# Altium project MEOWPOWER.PrjPcb
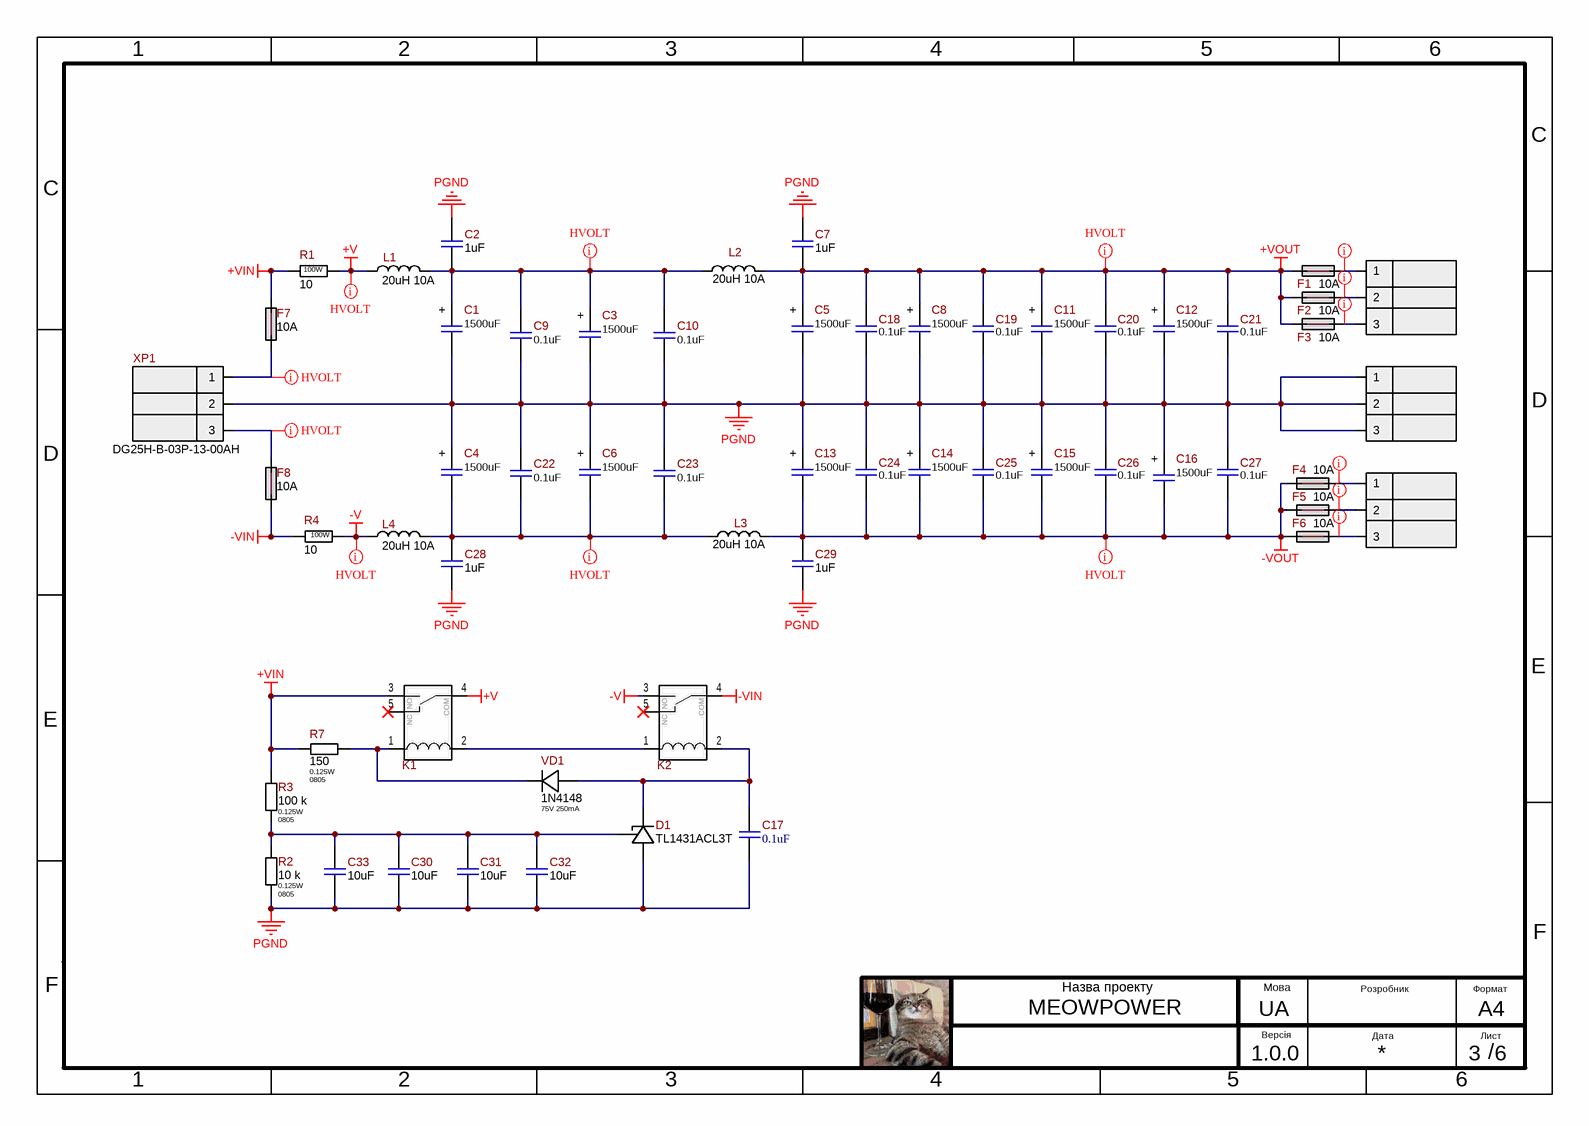
[diagram p0: MEOWPOWER.SchDoc]
__Project_Template_Version: 1.0.3; _PCB_Order_Thickness: 1.6 mm; _PCB_Order_Size: 0 x 0 mm; _PCB_Order_SilkColor: White; _PCB_Order_Silk: Yes; _PCB_Order_ProductionTime: 2 weeks; _PCB_Order_MinHole: 0.3 mm; _PCB_Order_Material: FR-4; _PCB_Order_MaskColor: Green / Yellow; _PCB_Order_Mask: on both sides; _PCB_Order_LayersCnt: 2; _PCB_Order_Finish: HASL; _PCB_Order_ElectricTest: Necessarily for 100% samples; _PCB_Order_Cooper: 1oz / 35um; _PCB_Order_CastellatedHolesEdges: No; _PCB_Order_BoardOutlineLayer: Mechanical1 (GM1); _PCB_Order_Accuracy: 0.2mm / 8mil; _Amount_Boards_Per_Stand: 1; Project_Version: 1.0.0; Product_Name: MEOWPOWER; Authors: Kozyr.I
1 sheet, 58 parts. Net scope: global (net labels, ports and power ports of the same name join across sheets).
Board file: MEOWPOWER.PcbDoc

## Sheet MEOWPOWER.SchDoc: =DocumentName
size 297 x 209 mm; Author: Kozyr.I; CompanyName: "AS Manufacturing" LLC; Organization: "AS Manufacturing" LLC; Address1: 5 Sklyarenka St.; Address2: Kyiv 04073; Address3: Ukraine; Address4: https://ajax.systems/en/; DocumentNumber: 3; Revision: v1.0.0; SheetNumber: 3; SheetTotal: 6; Product name: MEOWPOWER; Head: MEOWPOWER..v1.0.0; PCB_Designator: MEOWPOWER..v1.0.0; Template_version: 1.0.1

### Parts
C1  1500uF  [CAP-AE-PTH-180D05x400H20]
C2  1uF  [CAP 25x10MM]
C3  1500uF  [CAP-AE-PTH-180D05x400H20]
C4  1500uF  [CAP-AE-PTH-180D05x400H20]
C5  1500uF  [CAP-AE-PTH-180D05x400H20]
C6  1500uF  [CAP-AE-PTH-180D05x400H20]
C7  1uF  [CAP 25x10MM]
C8  1500uF  [CAP-AE-PTH-180D05x400H20]
C9  0.1uF  [C1206(3216)]
C10  0.1uF  [C1206(3216)]
C11  1500uF  [CAP-AE-PTH-180D05x400H20]
C12  1500uF  [CAP-AE-PTH-180D05x400H20]
C13  1500uF  [CAP-AE-PTH-180D05x400H20]
C14  1500uF  [CAP-AE-PTH-180D05x400H20]
C15  1500uF  [CAP-AE-PTH-180D05x400H20]
C16  1500uF  [CAP-AE-PTH-180D05x400H20]
C17  0.1uF  [C0805(2012)]
C18  0.1uF  [C1206(3216)]
C19  0.1uF  [C1206(3216)]
C20  0.1uF  [C1206(3216)]
C21  0.1uF  [C1206(3216)]
C22  0.1uF  [C1206(3216)]
C23  0.1uF  [C1206(3216)]
C24  0.1uF  [C1206(3216)]
C25  0.1uF  [C1206(3216)]
C26  0.1uF  [C1206(3216)]
C27  0.1uF  [C1206(3216)]
C28  1uF  [CAP 25x10MM]
C29  1uF  [CAP 25x10MM]
C30  10uF  [C0805(2012)]
C31  10uF  [C0805(2012)]
C32  10uF  [C0805(2012)]
C33  10uF  [C0805(2012)]
D1  TL1431ACL3T  [SOT-23]
F1  10A  [FUSE1808]
F2  10A  [FUSE1808]
F3  10A  [FUSE1808]
F4  10A  [FUSE1808]
F5  10A  [FUSE1808]
F6  10A  [FUSE1808]
F7  10A  [FUSE1808]
F8  10A  [FUSE1808]
K1  LEG-12  [Relay10A]  (value not drawn)
K2  LEG-12  [Relay10A]  (value not drawn)
L1  20uH 10A  [IND10x25x8.4]
L2  20uH 10A  [IND10x25x8.4]
L3  20uH 10A  [IND10x25x8.4]
L4  20uH 10A  [IND10x25x8.4]
R1  10  Power Rating: 100W  [RES_TO-247]
R2  10 k  Power Rating: 0.125W  Package/Case: 0805  [R0805]
R3  100 k  Power Rating: 0.125W  Package/Case: 0805  [R0805]
R4  10  Power Rating: 100W  [RES_TO-247]
R7  150  Power Rating: 0.125W  Package/Case: 0805  [R0805]
VD1  1N4148  Power Rating: 75V 250mA  [SOD-80]
XP1  DG25H-B-03P-13-00AH  [DG25H-B-03P]
XP2  DG25H-B-03P-13-00AH  [DG25H-B-03P]  (value not drawn)
XP3  DG25H-B-03P-13-00AH  [DG25H-B-03P]  (value not drawn)
XP4  DG25H-B-03P-13-00AH  [DG25H-B-03P]  (value not drawn)

### Nets
+V: K1.4(COM) L1.1 R1.2
+VIN: F7.2 K1.3(NO) R1.1 R3.2 R7.2
+VOUT: C5.1 C7.2 C8.1 C11.1 C12.1 C18.1 C19.1 C20.1 C21.1 F1.1 F2.1 F3.1 L2.2
-V: K2.3(NO) L4.1 R4.1
-VIN: F8.1 K2.4(COM) R4.2
-VOUT: C13.2 C14.2 C15.2 C16.2 C24.2 C25.2 C26.2 C27.2 C29.2 F4.1 F5.1 F6.1 L3.2
PGND: C1.2 C2.1 C3.2 C4.1 C5.2 C6.1 C7.1 C8.2 C9.1 C10.1 C11.2 C12.2 C13.1 C14.1 C15.1 C16.1 C17.1 C18.2 C19.2 C20.2 C21.2 C22.2 C23.2 C24.1 C25.1 C26.1 C27.1 C28.1 C29.1 C30.1 C31.1 C32.1 C33.1 D1.3(A) R2.1 XP1.2 XP3.1 XP3.2 XP3.3
NetC1_1: C1.1 C2.2 C3.1 C9.2 C10.2 L1.2 L2.1
NetC4_2: C4.2 C6.2 C22.1 C23.1 C28.2 L3.1 L4.2
NetC17_2: C17.2 D1.1(C) K2.2 VD1.2(A)
NetC30_2: C30.2 C31.2 C32.2 C33.2 D1.2(REF) R2.2 R3.1
NetF1_2: F1.2 XP2.1
NetF2_2: F2.2 XP2.2
NetF3_2: F3.2 XP2.3
NetF4_2: F4.2 XP4.1
NetF5_2: F5.2 XP4.2
NetF6_2: F6.2 XP4.3
NetF7_1: F7.1 XP1.1
NetF8_2: F8.2 XP1.3
NetK1_1: K1.1 R7.1 VD1.1(K)
NetK1_2: K1.2 K2.1

Not connected (* = marked no-connect by the designer): K1 5(NC)*; K2 5(NC)*

### Layout directives
net class HighVoltage: +V, +VOUT, -V, -VOUT, NetC1_1, NetC4_2, NetF1_2, NetF2_2, NetF3_2, NetF4_2, NetF5_2, NetF6_2, NetF7_1, NetF8_2

### Notes on the sheet
- 1
- 2
- 3
- 4
- 5
- 6
- C
- D
- E
- F
- Назва проекту
- Мова
- UA
- Розробник
- Формат
- A4
- Версія
- Дата
- Лист
- /
- (in symbol 1500uF  50V 18x35) +

### Library data of the parts
C1 C3-C6 C8 C11-C16 = 1500uF  50V 18x35: 1500uF 50V; Tolerance: ±10%; Name Component: Electrolytic capacitor; Operation Temperature: -55°C ~ 125°C; Library Path 1: Capacitors.SchLib; Value: 1500uF; Part Number: 1500uF  50V 18x35; ComponentLink1Description: Datasheet; Power (V/A): 50V; Package/Case: 18x35
C2 C7 C28 C29 = 1uF  275V 25x10: MKP 1uF 275V; Name Component: FILM CAP; Tolerance: ±10%; Operation Temperature: -55°C ~ 125°C; Library Path 1: Capacitors.SchLib; Part Number: 1uF  275V 25x10; Value: 1uF; Power (V/A): 275V; Package/Case: 25x10; ComponentLink1Description: Datasheet
C9 C10 C18-C27 = 0.1uF  50V С1206: CAP CER 0.1UF 50V X7R 1206; Manufacturer: AVX Corporation; Manufacturer P/N: 12065C104MYT4A; Tolerance: ±20%; Name Component: Capacitor Ceramic; Operation Temperature: -55°C ~ 105°C; Library Path 1: Capacitors.SchLib; Value: 0.1uF; Part Number: 0.1uF  50V С1206; ComponentLink1URL: http://catalogs.avx.com/SurfaceMount.pdf; Supplier 1: Digi-key; Supplier Part Number 1: 12065C104MYT4A-ND; ComponentLink1Description: Datasheet; Temperature Coefficient: X7R; Power (V/A): 50V; Package/Case: С1206
C17 = 0.1uF  50V C0805: CAP CER 0.1UF 50V X7R 0805; Manufacturer: AVX Corporation; Manufacturer P/N: 08055C104KAT2A; Tolerance: ±10%; Name Component: Capacitor Ceramic; Operation Temperature: -55°C ~ 105°C; Notes: 08055C104KAT4A,08055C104KAJ2A, 08055C104KAJ4A; Library Path 1: Capacitors.SchLib; Value: 0.1uF; Part Number: 0.1uF  50V C0805; ComponentLink1URL: http://catalogs.avx.com/SurfaceMount.pdf; Supplier 1: Digi-key; Supplier Part Number 1: 478-1395-2-ND; ComponentLink1Description: Datasheet; Temperature Coefficient: X7R; Power (V/A): 50V; Package/Case: C0805
C30-C33 = 10uF  16V C0805: CAP CER 10UF 16V X6S 0805; Manufacturer: Murata Electronics North America; Manufacturer P/N: GRM21BC81C106KA73L; Name Component: Capacitor Ceramic; Tolerance: ±10%; Operation Temperature: -55°C ~ 105°C; Library Path 1: Capacitors.SchLib; Part Number: 10uF  16V C0805; Value: 10uF; Temperature Coefficient: X6S; Power (V/A): 16V; Package/Case: C0805; Supplier 1: Digi-key; Supplier Part Number 1: 490-5519-2-ND; ComponentLink1Description: Datasheet; ComponentLink1URL: https://www.murata.com/~/media/webrenewal/support/library/catalog/products/capacitor/mlcc/c02e.ashx?la=en-us
D1 = TL1431ACL3T: IC VREF SHUNT ADJ  ±0.25% SOT23-3; Manufacturer: STMicroelectronics; Name Component: Voltage Reference; Operation Temperature: -40°C ~ 125°C (TA); Power (V/A): 2.495V / ,36 V; Library Path 1: Integrated Circuit.SchLib; Part Number: TL1431ACL3T; ComponentLink1URL: https://www.st.com/content/ccc/resource/technical/document/datasheet/43/6d/9e/69/31/63/4b/6e/CD00001246.pdf/files/CD00001246.pdf/jcr:content/translations/en.CD00001246.pdf; Supplier 1: Digi-key; Supplier Part Number 1: 497-16122-2-ND; ComponentLink1Description: Datasheet; Value: TL1431ACL3T; Package/Case: SOT-23-3; Manufacturer P/N: TL1431ACL3T
F1-F8 = 10A: Name Component: Fuse; Power (V/A): 10A 125V; Library Path 1: Others.SchLib; Part Number: 10A; Value: 10A; Package/Case: 1808
K1 K2 = LEG-12: General Purpose Relay, 1 Form C (1PDT), 12VDC 400Ohm Coil, 120VAC/24VDC @ 10A, 240VAC Max; Operation Temperature: -55°C ~ 125°C (TA); Power (V/A): 12V; Library Path 1: Others.SchLib; ComponentLink1URL: https://www.tme.eu/Document/311affc211749c2a4c93ad074af62b72/LEG-SERIES.pdf; ComponentLink1Description: Datasheet; Part Number: LEG-12; Name Component: Relay; Value: LEG-12; Supplier Part Number 1: Relay10A
L1-L4 = 20uH 10A: CASTOM; Name Component: FILTRE; Tolerance: ±10; Operation Temperature: -40°C ~ 125°C; Library Path 1: Inductance.SchLib; Part Number: 20uH 10A; Value: 20uH 10A; Power (V/A): 10A
R1 R4 = 10  RES_TO-247: Resistror 10 OHM  ±5% TO-247 100W; Operation Temperature: -55℃ to 155℃; Temperature Coefficient: ±200 ppm/°C; Library Path 1: Resistor.SchLib; Value: 10; Part Number: 10  RES_TO-247; Name Component: Resistror; Tolerance: ±5%
R2 = 10 k  R0805: RES SMD 10 k OHM  ±1% 1/8W 0805; Name Component: Resistror; Operation Temperature: -55℃ to 155℃; Temperature Coefficient: ±100 ppm/°C; Library Path 1: Resistor.SchLib; Part Number: 10 k  R0805; Value: 10 k; Tolerance: ±1%
R3 = 100 k  R0805: RES SMD 100 k OHM  ±1% 1/8W 0805; Name Component: Resistror; Operation Temperature: -55℃ to 155℃; Temperature Coefficient: ±100 ppm/°C; Library Path 1: Resistor.SchLib; Part Number: 100 k  R0805; Value: 100 k; Tolerance: ±1%
R7 = 150  R0805: RES SMD 150 OHM  ±1% 1/8W 0805; Name Component: Resistror; Operation Temperature: -55℃ to 155℃; Temperature Coefficient: ±100 ppm/°C; Library Path 1: Resistor.SchLib; Part Number: 150  R0805; Value: 150; Tolerance: ±1%
VD1 = 1N4148: DIODE GEN PURP 75V 250MA SOD323; Manufacturer: Diodes Incorporated; Operation Temperature: -55°C ~ 150°C; Library Path 1: Diodes.SchLib; Part Number: 1N4148; Name Component: Diode; Value: 1N4148; Package/Case: SOD-80; Manufacturer P/N: 1N4148; Supplier 1: Digi-key; Supplier Part Number 1: 1N4148; ComponentLink1Description: Datasheet
XP1 = DG25H-B-03P-13-00AH: 3PIN 7.62mm 300V 15 A  7-30 AWG; Name Component: Power Connectors; Operation Temperature: -65°C ~ 125°C; Library Path 1: Connectors.SchLib; Part Number: DG25H-B-03P-13-00AH; Value: DG25H-B-03P-13-00AH; Power (V/A): 300V 15 A; Package/Case: 7,62 mm; Supplier 1: RCS; ComponentLink1Description: Datasheet; ComponentLink1URL: https://www.rcscomponents.kiev.ua/datasheets/DG25H-B-XXP-1Y-00A%28H%29.Jpg
XP2-XP4 = DG25H-B-03P-13-00AH: 3PIN 7.62mm 300V 15 A  7-30 AWG; Name Component: Power Connectors; Operation Temperature: -65°C ~ 125°C; Library Path 1: Connectors.SchLib; System: Connector; Part Number: DG25H-B-03P-13-00AH; Value: DG25H-B-03P-13-00AH; Power (V/A): 300V 15 A; Package/Case: 7,62 mm; Supplier 1: RCS; ComponentLink1Description: Datasheet; ComponentLink1URL: https://www.rcscomponents.kiev.ua/datasheets/DG25H-B-XXP-1Y-00A%28H%29.Jpg